# EAGLE design LED (EAGLE 7.6.0)
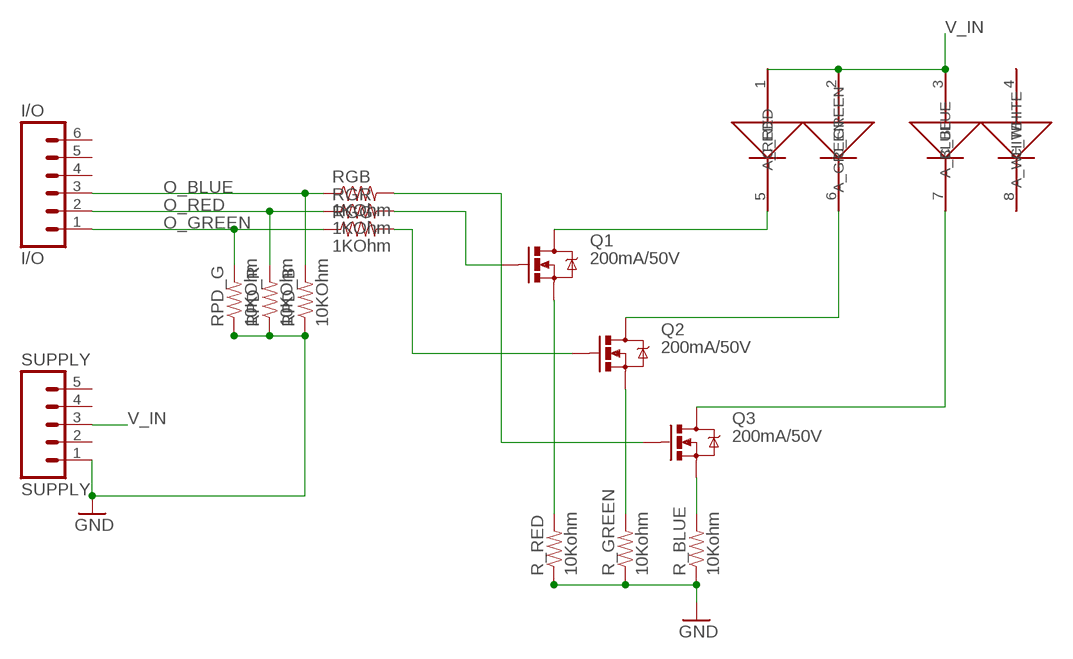
[diagram p0: schematic, sheet 1]

## Parts
I/O  I/O  M06NO_SILK_FEMALE_PTH  [1X06_NO_SILK]
Q1  200mA/50V  MOSFET-NCHANNELBSS138  [SOT23-3]
Q2  200mA/50V  MOSFET-NCHANNELBSS138  [SOT23-3]
Q3  200mA/50V  MOSFET-NCHANNELBSS138  [SOT23-3]
R_BLUE  10Kohm  RESISTOR0805-RES  [0805]
R_GREEN  10Kohm  RESISTOR0805-RES  [0805]
R_RED  10Kohm  RESISTOR0805-RES  [0805]
RGB  1KOhm  RESISTOR0805-RES  [0805]
RGG  1KOhm  RESISTOR0805-RES  [0805]
RGR  1KOhm  RESISTOR0805-RES  [0805]
RPD_B  10KOhm  RESISTOR0805-RES  [0805]
RPD_G  10KOhm  RESISTOR0805-RES  [0805]
RPD_R  10KOhm  RESISTOR0805-RES  [0805]
SUPPLY  SUPPLY  M05NO_SILK  [1X05_NO_SILK]
U$1  CREE_MCE4CTRGBW  [CLN6A]

## Nets
GND: R_BLUE.1 R_GREEN.1 R_RED.1 RPD_B.1 RPD_G.1 RPD_R.1 SUPPLY.1
N$1 [SUPPLY]: Q3.2(S) R_BLUE.2
N$2 [SUPPLY]: Q2.2(S) R_GREEN.2
N$3 [SUPPLY]: Q1.2(S) R_RED.2
N$4: Q2.1(G) RGG.2
N$5: Q1.1(G) RGR.2
N$6: Q3.1(G) RGB.2
N$7 [SUPPLY]: Q1.3(D) U$1.5(C_RED)
N$8 [SUPPLY]: Q2.3(D) U$1.6(C_GREEN)
N$9 [SUPPLY]: Q3.3(D) U$1.7(C_BLUE)
O_BLUE: I/O.3 RGB.1 RPD_B.2
O_GREEN: I/O.1 RGG.1 RPD_G.2
O_RED: I/O.2 RGR.1 RPD_R.2
V_IN [SUPPLY]: SUPPLY.3 U$1.1(A_RED) U$1.2(A_GREEN) U$1.3(A_BLUE)
Unconnected: I/O.4 I/O.5 I/O.6 SUPPLY.2 SUPPLY.4 SUPPLY.5 U$1.4(A_WHITE) U$1.8(C_WHITE)

## Library data of the parts
I/O = SparkFun-Connectors:M06: Header 6 Standard 6-pin 0.1" header. Use with straight break away headers (SKU : PRT-00116), right angle break away headers (PRT-00553), swiss pins (PRT-00743), machine pins (PRT-00117), and female headers (PRT-00115). Molex polarized connector foot print use with SKU : PRT-08094 with associated crimp pins and housings. NOTES ON THE VARIANTS LOCK and LOCK_LONGPADS... This footprint was designed to help hold the alignment of a through-hole component (i.e. 6-pin header) while soldering it into place. You may notice that each hole has been shifted either up or down by 0.005 of an inch from it's more standard position (which is a perfectly straight line). This slight alteration caused the pins (the squares in the middle) to touch the edges of the holes. Because they are alternating, it causes a "brace" to hold the component in place. 0.005 has proven to be the perfect amount of "off-center" position when using our standard breakaway headers. Although looks a little odd when you look at the bare footprint, once you have a header in there, the alteration is very hard to notice. Also,if you push a header all the way into place, it is covered up entirely on the bottom side. This idea of altering the position of holes to aid alignment will be further integrated into the Sparkfun Library for other footprints. It can help hold any component with 3 or more connection pins.; PROD_ID: CONN-08437
Q1-Q3 = SparkFun-DiscreteSemi:MOSFET-NCHANNEL: Common NMOSFET Parts MFG P/N Store ID Prod ID FDD8780 TRANS-09984 SI7820DN TRANS-11055 FDS6630A IC-08089 2N7002PW TRANS-11151 FQP30N06L COM-10213 TRANS-10060 BSS123LT1G TRANS-08345 BSS138 TRANS-00830 BS170 2N7000; PROD_ID: TRANS-00830
R_BLUE R_GREEN R_RED RGB RGG RGR RPD_B RPD_G RPD_R = SparkFun-Resistors:RESISTOR: Resistor Basic schematic elements and footprints for 0603, 1206, and PTH resistors.
SUPPLY = SparkFun-Connectors:M05: Header 5 Standard 5-pin 0.1" header. Use with straight break away headers (SKU : PRT-00116), right angle break away headers (PRT-00553), swiss pins (PRT-00743), machine pins (PRT-00117), and female headers (PRT-00115). Molex polarized connector foot print use with SKU : PRT-08230 with associated crimp pins and housings.
U$1 = led:CREE_MCE4CT: LED RGBW

## Net classes
0 default: width 0.3 mm
1 GND: width 0.5 mm, clearance 0.5 mm
2 SUPPLY: width 0.5 mm, clearance 0.003 mm

## Board
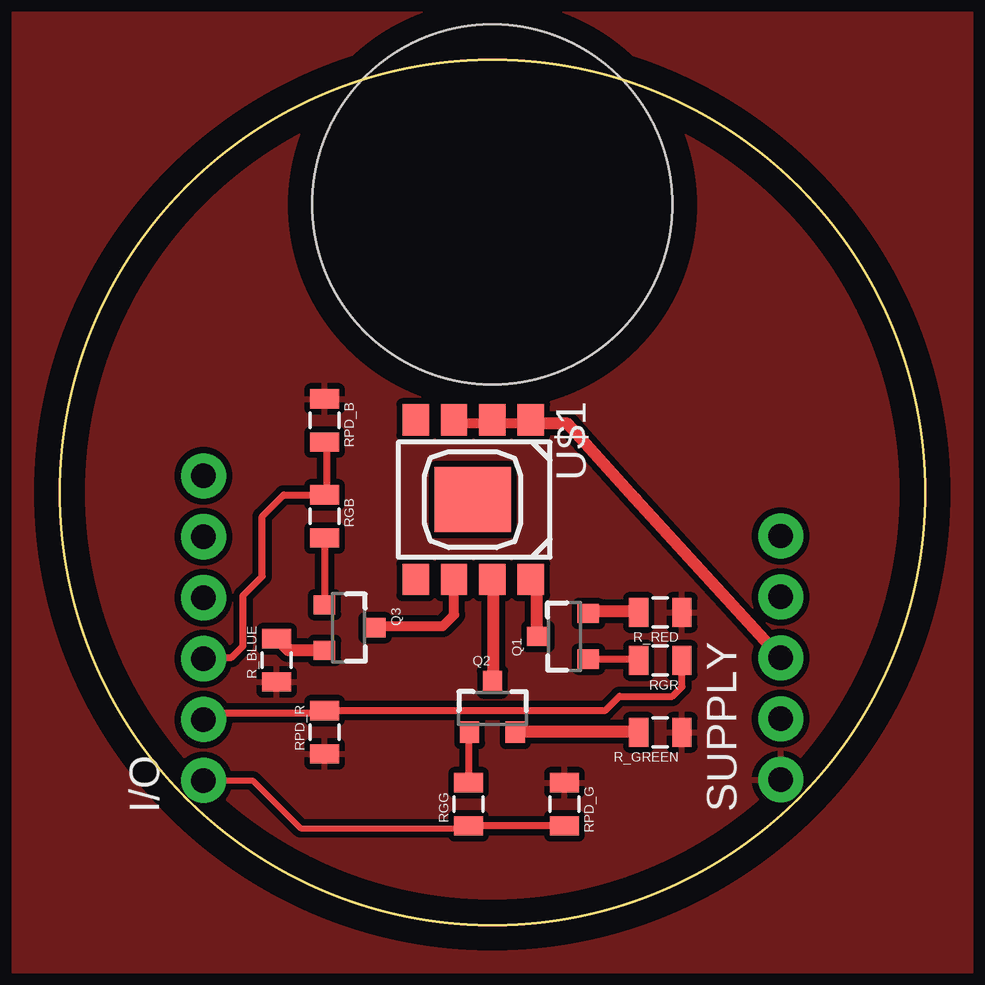
[diagram p1: board, top side]
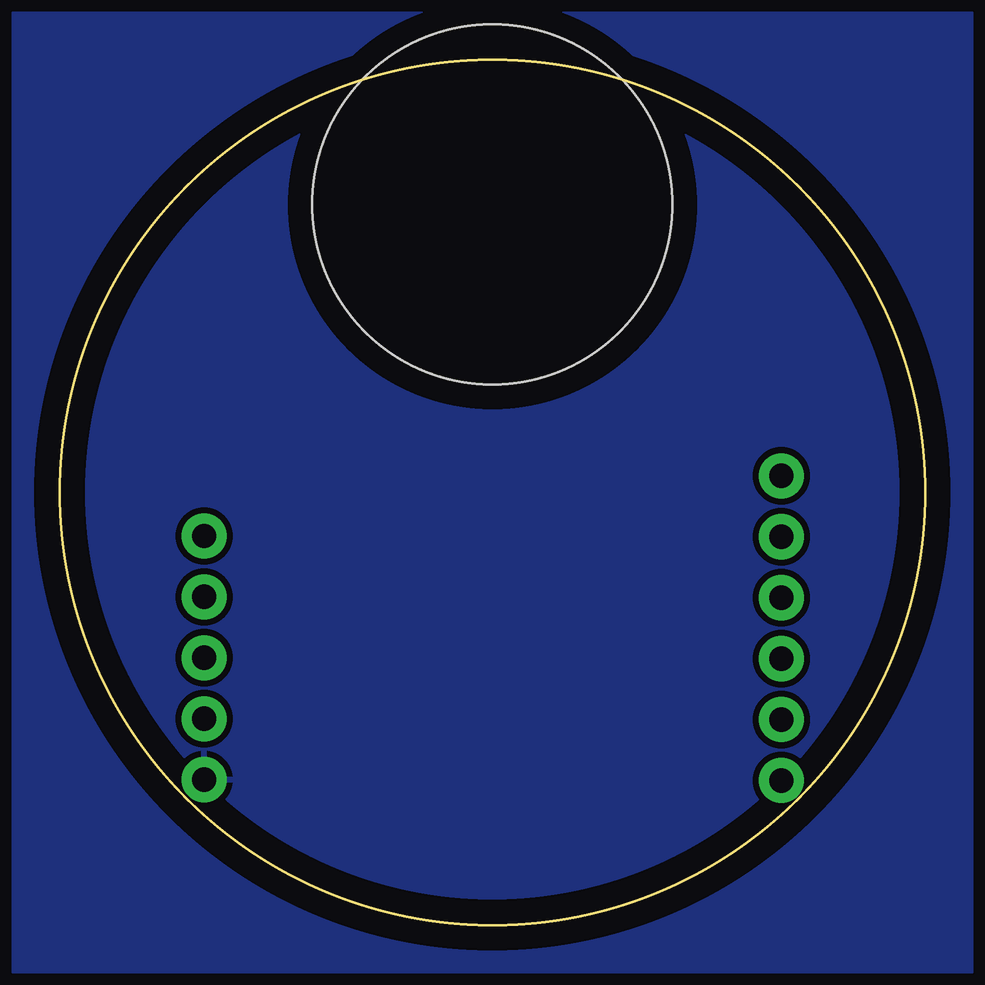
[diagram p2: board, bottom side, seen from below]

Size 36.06 x 36.06 mm. Coordinates in mm from the lower left corner, seen from the top.
Outline: circle at 18.03,18.03 radius 18.03
Copper layers (1*16): Top 0.035mm / dielectric 1.5mm / Bottom 0.035mm
Design rules "baballe": minimum track width 5mil, minimum drill 24mil, track to track 4mil, track to pad 4mil, pad to pad 4mil, via to via 4mil, smd to smd 2mil, copper to edge 40mil, drill to drill 8mil, minimum pad ring 10mil, minimum via ring 8mil, stop-mask expansion 4mil, vias tented up to drill 0mil, thermal gap 10mil
Holes 15 mm at 18.03,30.03

### Footprints (pad centres in the part's own frame; a part is rotated, then mirrored left to right if it is on the bottom)
1X06_NO_SILK = drill 1.016 pad 1.88: 1 0,0; 2 2.54,0; 3 5.08,0; 4 7.62,0; 5 10.16,0; 6 12.7,0
SOT23-3 = smd 0.8 x 0.9: 1 -0.95,-1; 2 0.95,-1; 3 0,1.1
0805 = smd 0.8 x 1.2: 1 -0.9,0; 2 0.9,0
1X05_NO_SILK = drill 1.016 pad 1.88: 1 0,0; 2 2.54,0; 3 5.08,0; 4 7.62,0; 5 10.16,0
CLN6A = smd 1.3 x 1.1: 1 -3.325,1.6; 2 -3.325,0; 3 -3.325,-1.6; 4 -3.325,-3.2; 5 3.325,1.6; 6 3.325,0; 7 3.325,-1.6; 8 3.33,-3.2 | smd 2.7 x 3.2: HT 0,-0.821

### Placement (x,y rotation side)
I/O  5.98,6.02 90 top
Q1  21.03,12.03 90 top
Q2  18.03,9.03 0 top
Q3  12.03,12.39 270 top
R_BLUE  9.03,11.03 90 top
R_GREEN  25.03,8.03 180 top
R_RED  25.03,13.03 180 top
RGB  11.03,17.03 270 top
RGG  17.03,5.03 90 top
RGR  25.03,11.03 180 top
RPD_B  11.03,21.03 270 top
RPD_G  21.03,5.03 270 top
RPD_R  11.03,8.03 90 top
SUPPLY  30.05,6.05 90 top
U$1  18.03,17.73 270 top

### Tracks (layer width: path | path; a pad name or v marks a point on that pad's centre or on a via)
GND
  pour Top (isolate 0.254): -0.97,38.03 38.03,38.03 38.03,-1.97 -1.97,-1.97 -1.97,38.03
  pour Bottom (isolate 0.254): -0.97,38.03 38.03,38.03 38.03,-1.97 -1.97,-1.97 -1.97,38.03
N$1
  Top 0.5: Q3.2 9.52,11.46 9.12,11.86 R_BLUE.2
N$2
  Top 0.5: Q2.2 19.05,8.04 24.07,8.04 R_GREEN.2
N$3
  Top 0.5: Q1.2 22.07,13.06 24.07,13.06 R_RED.2
N$4
  Top 0.3: Q2.1 17.05,7.94 17.05,5.94 RGG.2
N$5
  Top 0.3: Q1.1 22.07,11.06 24.07,11.06 RGR.2
N$6
  Top 0.3: Q3.1 11.02,13.36 11.02,16.08 RGB.2
N$7
  Top 0.5: Q1.3 19.86,12.06 19.86,14.47 19.66,14.67 U$1.5
N$8
  Top 0.5: Q2.3 18.05,10.15 18.05,14.67 U$1.6
N$9
  Top 0.406: 13.13,12.46 15.96,12.46 16.43,12.93 U$1.7
  Top 0.5: 16.34,14.47 16.34,14.67 U$1.7 | 13.13,12.46 Q3.3
O_BLUE
  Top 0.3: RGB.1 11.12,17.98 11.12,20.09 RPD_B.2 | 11.02,17.78 RGB.1 | I/O.3 6,11.16 7.16,11.16 7.63,11.63 7.63,13.73 8.43,14.53 8.43,17.03 9.33,17.93 RGB.1
O_GREEN
  Top 0.254: I/O.1 8.04,6.02 10.03,4.03 16.93,4.03 RGG.1
  Top 0.3: RGG.1 17.05,4.13 20.96,4.13 RPD_G.2
O_RED
  Top 0.3: I/O.2 6,8.65 6.2,8.85 11.02,8.85 RPD_R.2 11.12,8.95 22.75,8.95 23.33,9.53 25.53,9.53 25.93,9.93 RGR.1
V_IN
  Top 0.406: 18.18,20.9 16.58,20.9 U$1.3 | 19.36,20.9 18.18,20.9 | 18.18,20.9 U$1.2
  Top 0.5: U$1.1 19.36,20.9 21.16,20.9 24,17.76 SUPPLY.3